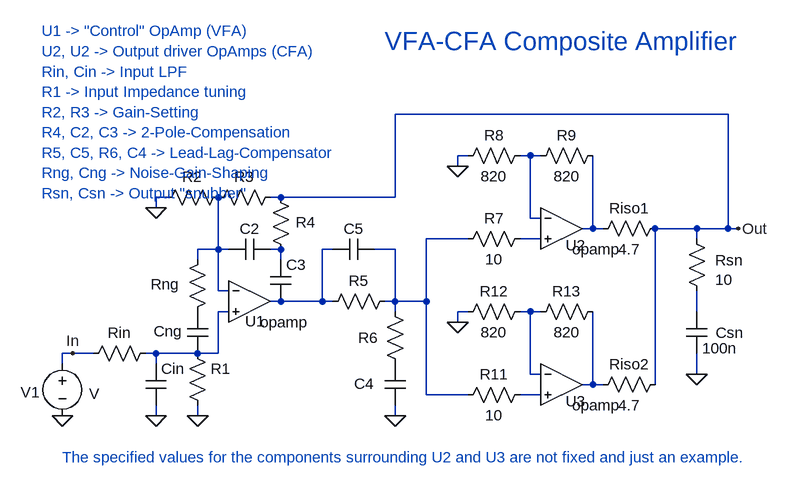
[diagram p0: schematic VFA-CFA_conceptual.asc]
VFA-CFA_conceptual.asc, the LTspice schematic file:
Version 4
SHEET 1 1028 680
WIRE 960 -112 448 -112
WIRE 560 -48 544 -48
WIRE 656 -48 640 -48
WIRE 672 -48 656 -48
WIRE 544 -32 544 -48
WIRE 96 16 80 16
WIRE 272 16 256 16
WIRE 448 16 448 -112
WIRE 448 16 272 16
WIRE 80 32 80 16
WIRE 656 48 656 -48
WIRE 672 48 656 48
WIRE 752 64 752 -48
WIRE 752 64 736 64
WIRE 768 64 752 64
WIRE 912 64 848 64
WIRE 960 64 960 -112
WIRE 960 64 912 64
WIRE 976 64 960 64
WIRE 560 80 496 80
WIRE 672 80 640 80
WIRE 912 80 912 64
WIRE 176 96 176 16
WIRE 176 96 144 96
WIRE 192 96 176 96
WIRE 272 96 256 96
WIRE 352 96 336 96
WIRE 448 96 416 96
WIRE 144 112 144 96
WIRE 272 112 272 96
WIRE 176 160 176 96
WIRE 192 160 176 160
WIRE 272 176 256 176
WIRE 336 176 336 96
WIRE 336 176 272 176
WIRE 352 176 336 176
WIRE 448 176 448 96
WIRE 448 176 432 176
WIRE 496 176 496 80
WIRE 496 176 448 176
WIRE 192 192 176 192
WIRE 448 192 448 176
WIRE 560 192 544 192
WIRE 656 192 640 192
WIRE 672 192 656 192
WIRE 912 192 912 160
WIRE 544 208 544 192
WIRE -48 256 -64 256
WIRE -16 256 -48 256
WIRE 80 256 64 256
WIRE 144 256 80 256
WIRE 176 256 176 192
WIRE 176 256 144 256
WIRE -64 272 -64 256
WIRE 80 272 80 256
WIRE 656 288 656 192
WIRE 672 288 656 288
WIRE 912 288 912 256
WIRE 752 304 752 192
WIRE 752 304 736 304
WIRE 768 304 752 304
WIRE 848 304 848 64
WIRE 496 320 496 176
WIRE 560 320 496 320
WIRE 672 320 640 320
WIRE 80 352 80 336
WIRE 144 352 144 336
WIRE 448 352 448 336
FLAG -48 256 In
FLAG 80 352 0
FLAG -64 352 0
FLAG 144 352 0
FLAG 80 32 0
FLAG 448 352 0
FLAG 544 -32 0
FLAG 544 208 0
FLAG 912 288 0
FLAG 976 64 Out
SYMBOL OpAmps/opamp 224 112 R0
WINDOW 0 -7 95 Left 2
SYMATTR InstName U1
SYMBOL OpAmps/opamp 704 0 R0
WINDOW 0 6 90 Left 2
SYMATTR InstName U2
SYMBOL res 80 240 R90
WINDOW 0 0 56 VBottom 2
WINDOW 3 32 56 VTop 2
SYMATTR InstName Rin
SYMATTR Value ""
SYMBOL cap 64 272 R0
SYMATTR InstName Cin
SYMATTR Value ""
SYMBOL res 160 96 M0
WINDOW 0 44 54 Left 2
WINDOW 3 39 67 Left 2
SYMATTR InstName Rng
SYMATTR Value ""
SYMBOL cap 160 192 M0
WINDOW 0 39 30 Left 2
WINDOW 3 47 49 Left 2
SYMATTR InstName Cng
SYMATTR Value ""
SYMBOL voltage -64 256 R0
WINDOW 0 -64 60 Left 2
WINDOW 3 41 62 Left 2
SYMATTR InstName V1
SYMBOL res 128 240 R0
SYMATTR InstName R1
SYMATTR Value ""
SYMBOL res 192 0 R90
WINDOW 0 0 56 VBottom 2
WINDOW 3 32 56 VTop 2
SYMATTR InstName R2
SYMATTR Value ""
SYMBOL res 272 0 R90
WINDOW 0 0 56 VBottom 2
WINDOW 3 32 56 VTop 2
SYMATTR InstName R3
SYMATTR Value ""
SYMBOL cap 256 80 R90
WINDOW 0 0 32 VBottom 2
WINDOW 3 19 12 VTop 2
SYMATTR InstName C2
SYMATTR Value ""
SYMBOL cap 256 176 M180
WINDOW 0 24 56 Left 2
WINDOW 3 24 8 Left 2
SYMATTR InstName C3
SYMATTR Value ""
SYMBOL res 256 0 R0
WINDOW 0 39 54 Left 2
SYMATTR InstName R4
SYMATTR Value ""
SYMBOL res 448 160 R90
WINDOW 0 0 56 VBottom 2
WINDOW 3 32 56 VTop 2
SYMATTR InstName R5
SYMATTR Value ""
SYMBOL res 464 288 R180
WINDOW 0 42 56 Left 2
WINDOW 3 36 40 Left 2
SYMATTR InstName R6
SYMATTR Value ""
SYMBOL cap 464 272 M0
WINDOW 0 48 31 Left 2
SYMATTR InstName C4
SYMATTR Value ""
SYMBOL cap 416 80 R90
WINDOW 0 0 32 VBottom 2
WINDOW 3 32 32 VTop 2
SYMATTR InstName C5
SYMATTR Value ""
SYMBOL res 656 64 R90
WINDOW 0 0 56 VBottom 2
WINDOW 3 32 56 VTop 2
SYMATTR InstName R7
SYMATTR Value 10
SYMBOL res 656 -64 R90
WINDOW 0 0 56 VBottom 2
WINDOW 3 32 56 VTop 2
SYMATTR InstName R8
SYMATTR Value 820
SYMBOL res 768 -64 R90
WINDOW 0 0 56 VBottom 2
WINDOW 3 32 56 VTop 2
SYMATTR InstName R9
SYMATTR Value 820
SYMBOL res 864 48 R90
WINDOW 0 0 56 VBottom 2
WINDOW 3 32 56 VTop 2
SYMATTR InstName Riso1
SYMATTR Value 4.7
SYMBOL OpAmps/opamp 704 240 R0
WINDOW 0 6 90 Left 2
SYMATTR InstName U3
SYMBOL res 656 304 R90
WINDOW 0 0 56 VBottom 2
WINDOW 3 32 56 VTop 2
SYMATTR InstName R11
SYMATTR Value 10
SYMBOL res 656 176 R90
WINDOW 0 0 56 VBottom 2
WINDOW 3 32 56 VTop 2
SYMATTR InstName R12
SYMATTR Value 820
SYMBOL res 768 176 R90
WINDOW 0 0 56 VBottom 2
WINDOW 3 32 56 VTop 2
SYMATTR InstName R13
SYMATTR Value 820
SYMBOL res 864 288 R90
WINDOW 0 0 56 VBottom 2
WINDOW 3 32 56 VTop 2
SYMATTR InstName Riso2
SYMATTR Value 4.7
SYMBOL res 896 64 R0
WINDOW 0 44 49 Left 2
WINDOW 3 44 79 Left 2
SYMATTR InstName Rsn
SYMATTR Value 10
SYMBOL cap 896 192 R0
WINDOW 0 45 32 Left 2
SYMATTR InstName Csn
SYMATTR Value 100n
TEXT -96 -240 Left 2 ;U1 -> "Control" OpAmp (VFA)\nU2, U2 -> Output driver OpAmps (CFA)\nRin, Cin -> Input LPF\nR1 -> Input Impedance tuning\nR2, R3 -> Gain-Setting\nR4, C2, C3 -> 2-Pole-Compensation\nR5, C5, R6, C4 -> Lead-Lag-Compensator\nRng, Cng -> Noise-Gain-Shaping\nRsn, Csn -> Output "snubber"
TEXT -64 416 Left 2 ;The specified values for the components surrounding U2 and U3 are not fixed and just an example.
TEXT 432 -224 Left 4 ;VFA-CFA Composite Amplifier

The netlist it stands for:
* VFA-CFA_conceptual.asc
XU1 N005 N008 N007 opamp Aol=100K GBW=10Meg  ; pins invin noninvin out
XU2 N001 N004 N002 opamp Aol=100K GBW=10Meg  ; pins invin noninvin out
Rin N008 In
Cin N008 0
Rng N005 P001
Cng P001 N008
V1 In 0 V
R1 N008 0
R2 N005 0
R3 Out N005
C2 N006 N005
C3 N007 N006
R4 Out N006
R5 N003 N007
R6 P002 N003
C4 P002 0
C5 N003 N007
R7 N004 N003 10
R8 N001 0 820
R9 N002 N001 820
Riso1 Out N002 4.7
XU3 N009 N012 N011 opamp Aol=100K GBW=10Meg  ; pins invin noninvin out
R11 N012 N003 10
R12 N009 0 820
R13 N011 N009 820
Riso2 Out N011 4.7
Rsn Out N010 10
Csn N010 0 100n
* U1 -> "Control" OpAmp (VFA)
* U2, U2 -> Output driver OpAmps (CFA)
* Rin, Cin -> Input LPF
* R1 -> Input Impedance tuning
* R2, R3 -> Gain-Setting
* R4, C2, C3 -> 2-Pole-Compensation
* R5, C5, R6, C4 -> Lead-Lag-Compensator
* Rng, Cng -> Noise-Gain-Shaping
* Rsn, Csn -> Output "snubber"
* The specified values for the components surrounding U2 and U3 are not fixed and just an example.
* VFA-CFA Composite Amplifier
.backanno
.end